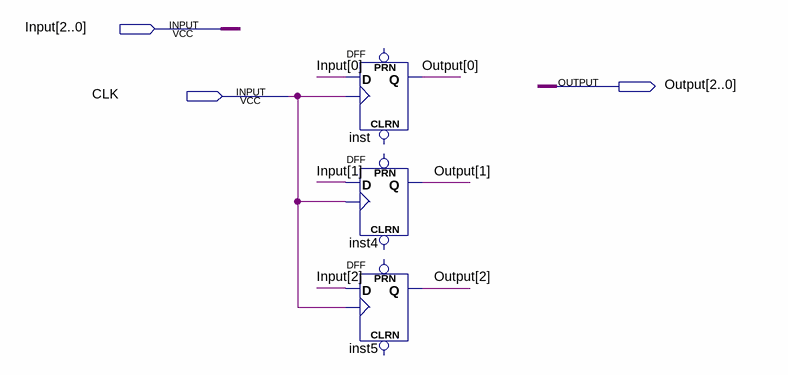
[diagram p0: schematic sheet]
// Quartus schematic State_memory.bdf as structural Verilog: 3 symbols, 3 pins
module State_memory (
  input  [2:0] Input,
  input  CLK,
  output [2:0] Output
);

  DFF inst (.CLK(CLK), .D(Input[0]), .Q(Output[0]));  // open: CLRN, PRN
  DFF inst4 (.CLK(CLK), .D(Input[1]), .Q(Output[1]));  // open: CLRN, PRN
  DFF inst5 (.CLK(CLK), .D(Input[2]), .Q(Output[2]));  // open: CLRN, PRN
endmodule
